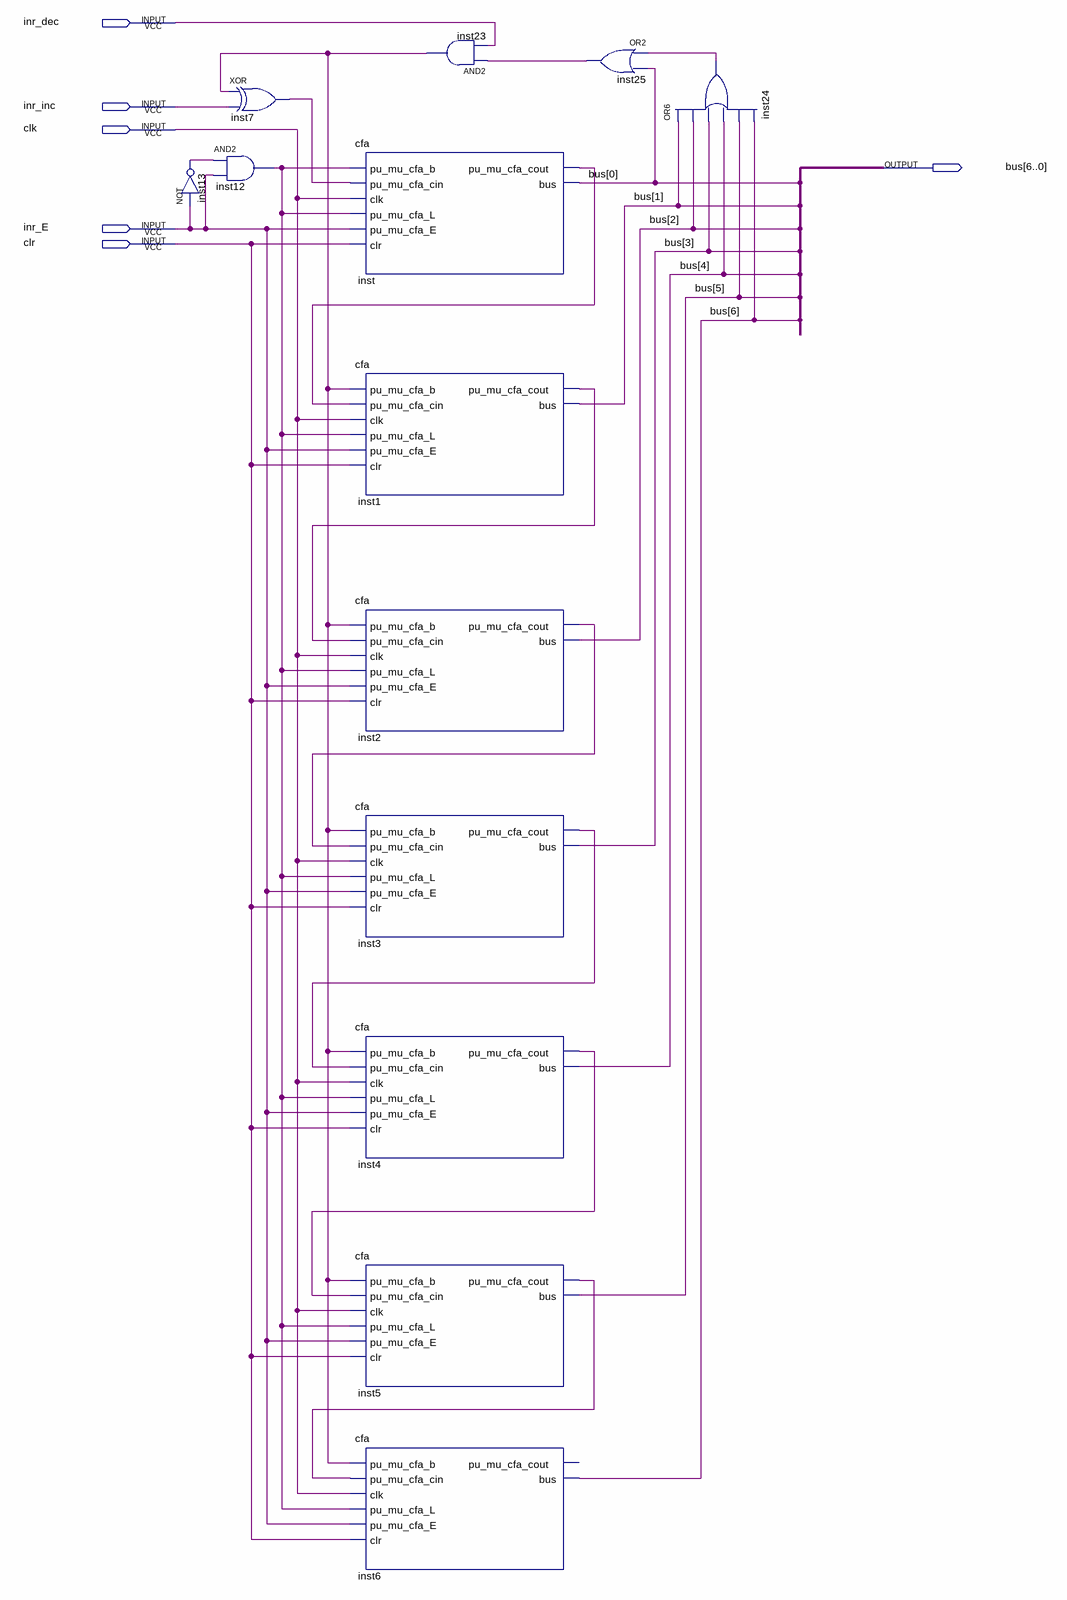
[diagram p0: schematic sheet]
// Quartus schematic inr.bdf as structural Verilog: 13 symbols, 6 pins
module inr (
  input  inr_dec,
  input  inr_inc,
  input  clk,
  input  inr_E,
  input  clr,
  output [6:0] bus
);

  wire inst1_pu_mu_cfa_cout, inst2_pu_mu_cfa_cout, inst3_pu_mu_cfa_cout, inst4_pu_mu_cfa_cout,
       inst5_pu_mu_cfa_cout, inst7_out, inst12_out, inst13_out, inst23_out, inst24_out, inst25_out,
       inst_pu_mu_cfa_cout;

  not inst13 (inst13_out, inr_E);
  xor inst7 (inst7_out, inst23_out, inr_inc);
  and inst12 (inst12_out, inst13_out, inr_E);
  cfa inst (
    .pu_mu_cfa_b(inst12_out), .pu_mu_cfa_cin(inst7_out), .clk(clk), .pu_mu_cfa_L(inst12_out),
    .pu_mu_cfa_E(inr_E), .clr(clr), .pu_mu_cfa_cout(inst_pu_mu_cfa_cout), .bus(bus[0]));
  cfa inst1 (
    .pu_mu_cfa_b(inst23_out), .pu_mu_cfa_cin(inst_pu_mu_cfa_cout), .clk(clk), .pu_mu_cfa_L(inst12_out),
    .pu_mu_cfa_E(inr_E), .clr(clr), .pu_mu_cfa_cout(inst1_pu_mu_cfa_cout), .bus(bus[1]));
  cfa inst2 (
    .pu_mu_cfa_b(inst23_out), .pu_mu_cfa_cin(inst1_pu_mu_cfa_cout), .clk(clk), .pu_mu_cfa_L(inst12_out),
    .pu_mu_cfa_E(inr_E), .clr(clr), .pu_mu_cfa_cout(inst2_pu_mu_cfa_cout), .bus(bus[2]));
  cfa inst3 (
    .pu_mu_cfa_b(inst23_out), .pu_mu_cfa_cin(inst2_pu_mu_cfa_cout), .clk(clk), .pu_mu_cfa_L(inst12_out),
    .pu_mu_cfa_E(inr_E), .clr(clr), .pu_mu_cfa_cout(inst3_pu_mu_cfa_cout), .bus(bus[3]));
  cfa inst4 (
    .pu_mu_cfa_b(inst23_out), .pu_mu_cfa_cin(inst3_pu_mu_cfa_cout), .clk(clk), .pu_mu_cfa_L(inst12_out),
    .pu_mu_cfa_E(inr_E), .clr(clr), .pu_mu_cfa_cout(inst4_pu_mu_cfa_cout), .bus(bus[4]));
  cfa inst5 (
    .pu_mu_cfa_b(inst23_out), .pu_mu_cfa_cin(inst4_pu_mu_cfa_cout), .clk(clk), .pu_mu_cfa_L(inst12_out),
    .pu_mu_cfa_E(inr_E), .clr(clr), .pu_mu_cfa_cout(inst5_pu_mu_cfa_cout), .bus(bus[5]));
  cfa inst6 (
    .pu_mu_cfa_b(inst23_out), .pu_mu_cfa_cin(inst5_pu_mu_cfa_cout), .clk(clk), .pu_mu_cfa_L(inst12_out),
    .pu_mu_cfa_E(inr_E), .clr(clr), .bus(bus[6]));  // open: pu_mu_cfa_cout
  and inst23 (inst23_out, inst25_out, inr_dec);
  or inst25 (inst25_out, inst24_out, bus[0]);
  or inst24 (inst24_out, bus[1], bus[2], bus[3], bus[4], bus[5], bus[6]);
endmodule
